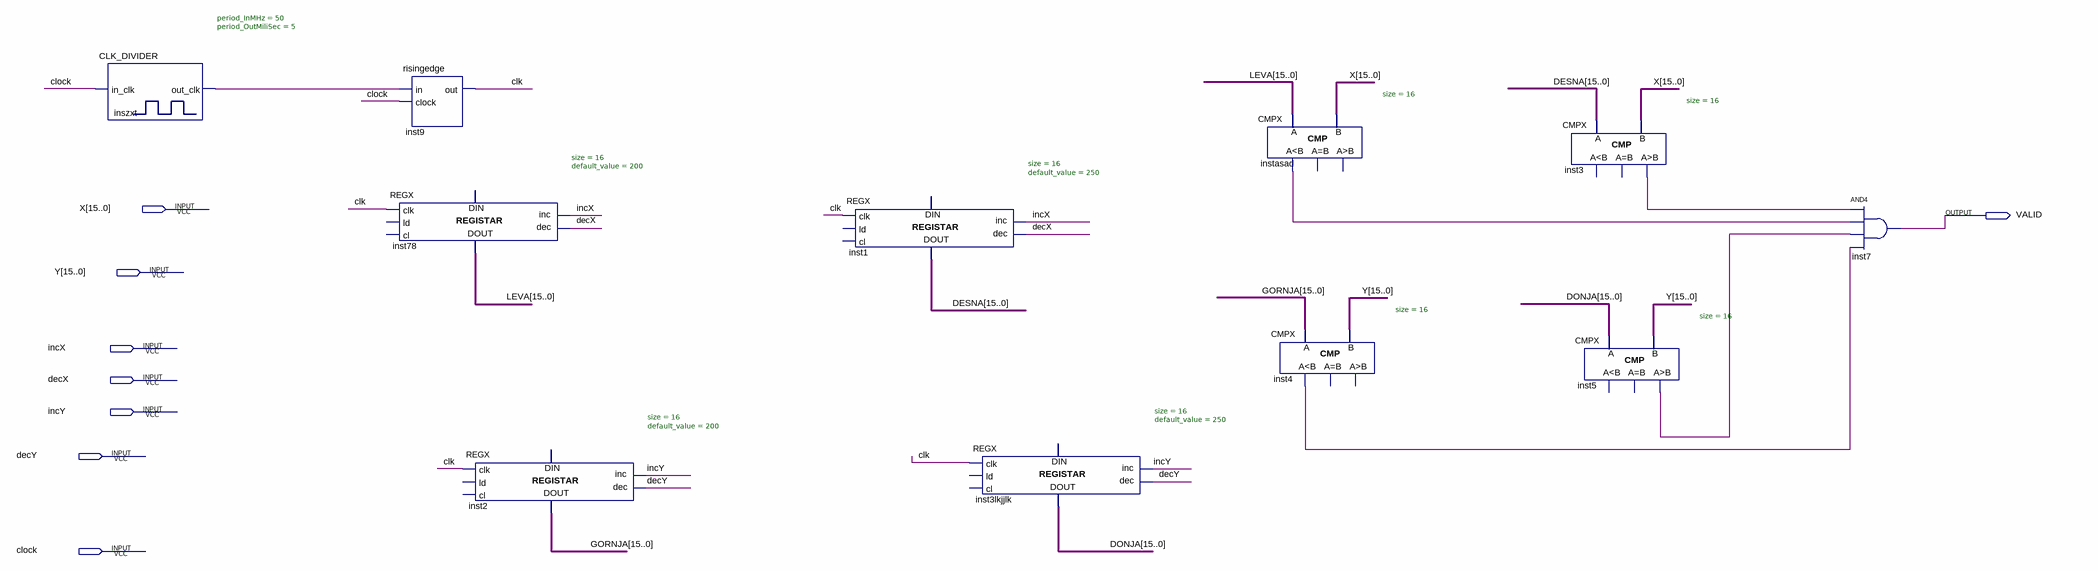
[diagram p0: schematic sheet]
// Quartus schematic KOCKA.bdf as structural Verilog: 11 symbols, 8 pins
module KOCKA (
  input  [15:0] X,
  input  [15:0] Y,
  input  incX,
  input  decX,
  input  incY,
  input  decY,
  input  clock,
  output VALID
);

  wire clk, inst3_gr, inst4_ls, inst5_gr, instasad_ls, inszxt_out_clk;
  wire [15:0] DESNA, DONJA, GORNJA, LEVA;

  CLK_DIVIDER #(.period_InMHz(50), .period_OutMiliSec(5)) inszxt (.in_clk(clock), .out_clk(inszxt_out_clk));
  risingedge inst9 (.in(inszxt_out_clk), .clock(clock), .out(clk));
  REGX #(.size(16), .default_value(200)) inst78 (
    .clk(clk), .inc(incX), .dec(decX), .data_out(LEVA));  // open: ld, cl, data_in
  REGX #(.size(16), .default_value(200)) inst2 (
    .clk(clk), .inc(incY), .dec(decY), .data_out(GORNJA));  // open: ld, cl, data_in
  REGX #(.size(16), .default_value(250)) inst1 (
    .clk(clk), .inc(incX), .dec(decX), .data_out(DESNA));  // open: ld, cl, data_in
  REGX #(.size(16), .default_value(250)) inst3lkjjlk (
    .clk(clk), .inc(incY), .dec(decY), .data_out(DONJA));  // open: ld, cl, data_in
  CMPX #(.size(16)) instasad (.A(LEVA), .B(X), .ls(instasad_ls));  // open: eq, gr
  CMPX #(.size(16)) inst4 (.A(GORNJA), .B(Y), .ls(inst4_ls));  // open: eq, gr
  CMPX #(.size(16)) inst3 (.A(DESNA), .B(X), .gr(inst3_gr));  // open: ls, eq
  CMPX #(.size(16)) inst5 (.A(DONJA), .B(Y), .gr(inst5_gr));  // open: ls, eq
  and inst7 (VALID, inst3_gr, instasad_ls, inst5_gr, inst4_ls);
endmodule
